# Altium schematic sheet P1.schdoc
size 297 x 210 mm; Symbol: Sheet-Symbol_A4; Company: 嘉立创EDA; Version: V1.0; Page Size: A4; @Project Name: AI开发板; @Page Count: 1; @Update Date: 2025-05-15; @Create Date: 2025-04-25; @Schematic Name: ESP-AI-V2; @Page No: 0; @Page Name: P1; Device: Sheet-Symbol_A4; @Board Name: Board2; @Create Time: 01:21:51; @Update Time: 10:08:04
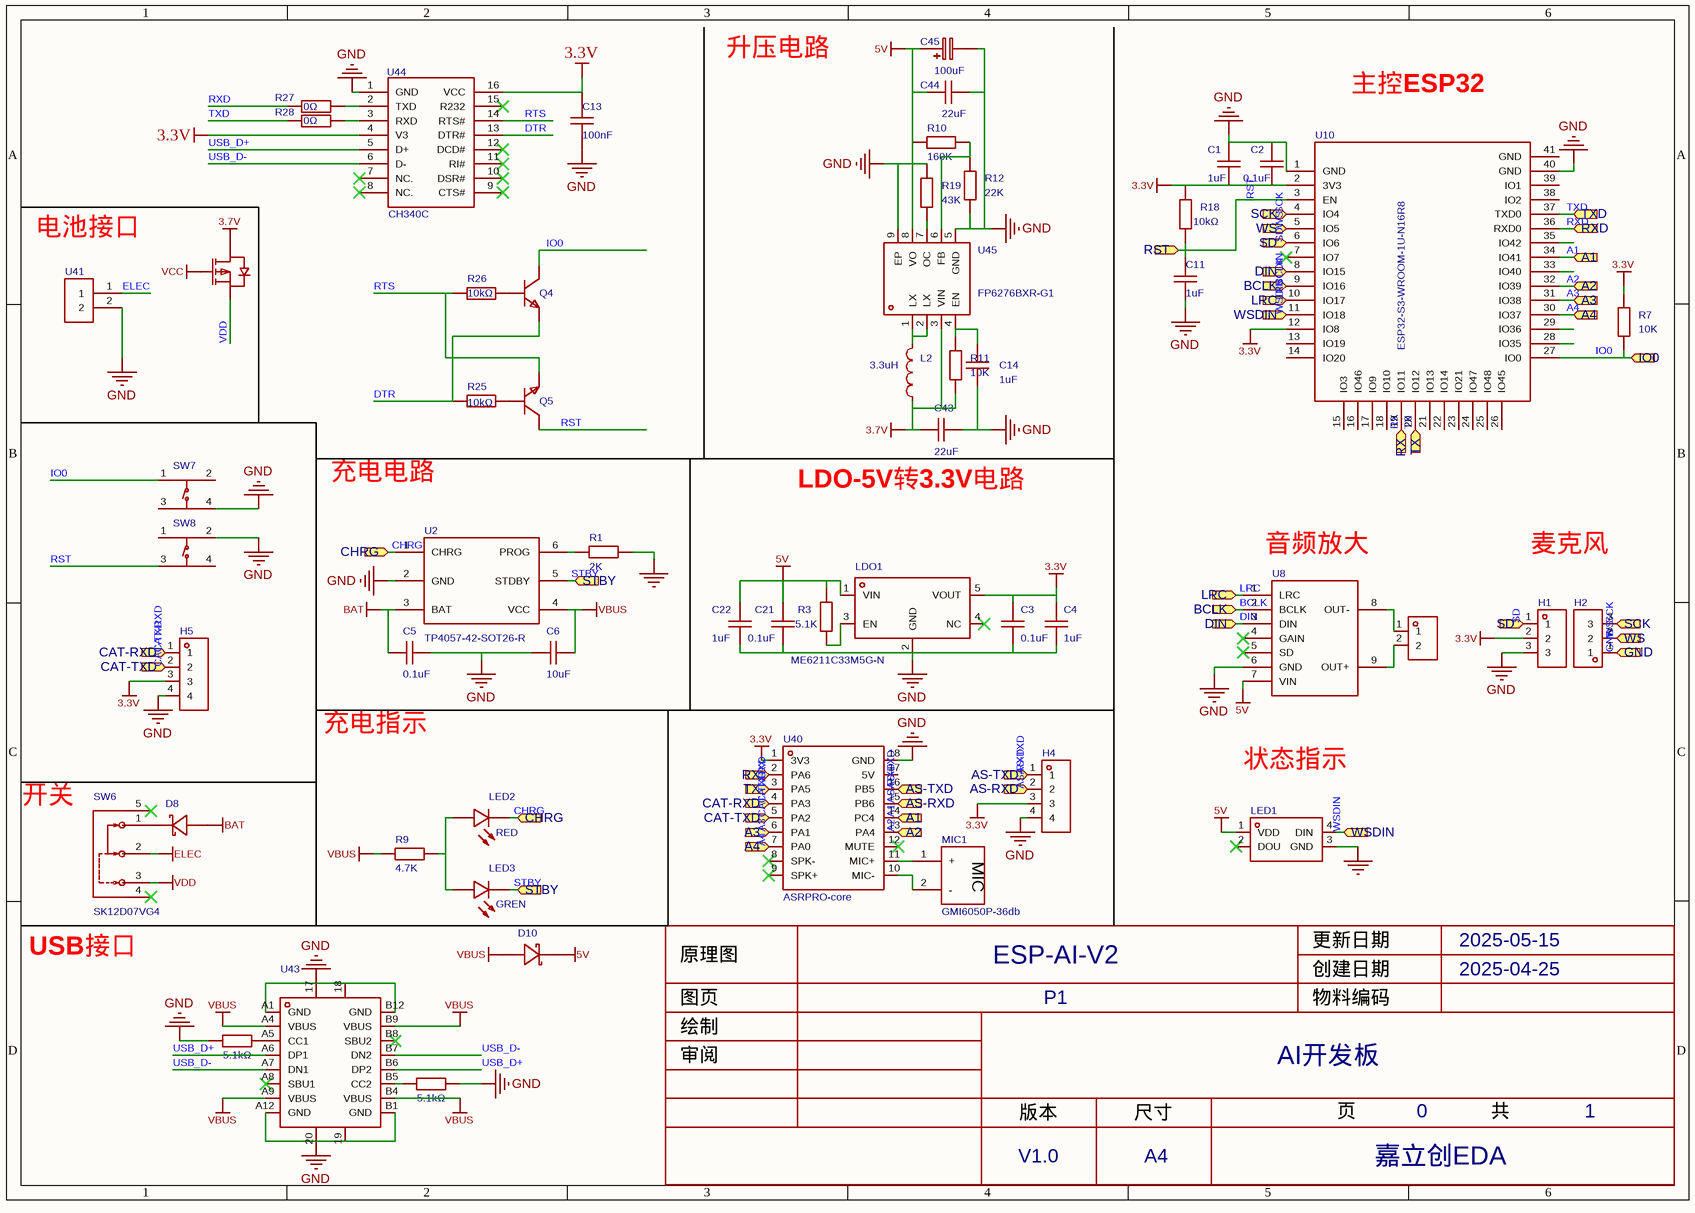
[diagram p0: P1.schdoc]

## Parts
C1  1uF  [C0603]
C2  0.1uF  [C0603]
C3  0.1uF  [C0603]
C4  1uF  [C0603]
C5  0.1uF  [C0603]
C6  10uF  [C0603]
C11  value 1uF  [C0603]  (hidden comment: CL10A105KB8NNNC)
C13  value 100nF  [C0603]  (hidden comment: CC0603KRX7R9BB104)
C14  1uF  [C0805]
C21  0.1uF  [C0603]
C22  1uF  [C0603]
C43  22uF  [C0805]
C44  22uF  [C0805]
C45  100uF  [CAP-SMD_L3.5-W2.8]
D8  1N5819WS_C727116  [SOD-323_L1.6-W1.3-LS2.7-RD]  (value not drawn)
D10  1N5819WS  [SOD-323_L1.8-W1.3-LS2.5-RD]  (value not drawn)
H1  PZ254V-11-03P  [HDR-TH_3P-P2.54-V-M]  (value not drawn)
H2  PZ254V-11-03P  [HDR-TH_3P-P2.54-V-M]  (value not drawn)
H3  PZ254V-11-02P  [HDR-TH_2P-P2.54-V-M]  (value not drawn)
H4  PZ254V-11-04P  [HDR-TH_4P-P2.54-V-M]  (value not drawn)
H5  PZ254V-11-04P  [HDR-TH_4P-P2.54-V-M]  (value not drawn)
L2  3.3uH  [IND-SMD_L7.0-W6.6]
LDO1  ME6211C33M5G-N  [SOT-23-5_L3.0-W1.7-P0.95-LS2.8-BL]
LED1  XL-5050RGBC-WS2812B  [LED-SMD_4P-L5.0-W5.0-BL_XL-5050RGBC]  (value not drawn)
LED2  RED  [LED0603-RD_RED]
LED3  GREN  [LED0603-RD_RED]
MIC1  GMI6050P-36db  [MIC-TH_BD6.0-P1.90-D0.4-L-FD_GMI6050P-2CXXDB]
Q2  AO3401_C727156  [SOT-23-3_L2.9-W1.4-P1.90-LS2.6-BR]  (value not drawn)
Q4  SS8050_C2150  [SOT-23-3_L2.9-W1.3-P1.90-LS2.4-BR]  (value not drawn)
Q5  SS8050_C2150  [SOT-23-3_L2.9-W1.3-P1.90-LS2.4-BR]  (value not drawn)
R1  2K  [R0603]
R3  5.1K  [R0603]
R6  value 5.1kΩ  [R0603]  (hidden comment: 0603WAF5101T5E)
R7  10K  [R0603]
R9  4.7K  [R0603]
R10  160K  [R0805_1]
R11  10K  [R0805_1]
R12  22K  [R0805_1]
R18  value 10kΩ  [R0603]  (hidden comment: 0603WAF1002T5E)
R19  43K  [R0805_1]
R23  value 5.1kΩ  [R0603]  (hidden comment: 0603WAF5101T5E)
R25  10kΩ  [R0603]
R26  10kΩ  [R0603]
R27  value 0Ω  [R0603]  (hidden comment: 0603WAF0000T5E)
R28  value 0Ω  [R0603]  (hidden comment: 0603WAF0000T5E)
SW6  SK12D07VG4  [SW-TH_SK12D07VG4]
SW7  TS-KG89S-AT25F  [SW-SMD_4P-L4.2-W3.3-P2.15-LS5.1]  (value not drawn)
SW8  TS-KG89S-AT25F  [SW-SMD_4P-L4.2-W3.3-P2.15-LS5.1]  (value not drawn)
U2  TP4057-42-SOT26-R  [SOT-23-6_L2.9-W1.6-P0.95-LS2.8-BL]
U8  (no value)  [MAX98357moudle]
U10  ESP32-S3-WROOM-1U-N16R8  [WIRELM-SMD_ESP32-S3-WROOM-1U]
U40  ASRPRO-core  [COMM-SMD_ASRPRO-CORE-V1.1]
U41  (no value)  [1*2-2.54单排针]
U43  24018-UCAF001-A  [TYPE-C-USB-SMD_CF003]  (value not drawn)
U44  CH340C  [SOP-16_L10.0-W3.9-P1.27-LS6.0-BL]
U45  FP6276BXR-G1  [SOP-8_L4.9-W3.9-P1.27-LS6.0-BL-EP]

## Ports
A1 (in), A2 (in), A3 (in), A4 (in), AS-RXD (in), AS-TXD (in), BCLK (in), CAT-RXD (in), CAT-TXD (in), CHRG (in), DIN (in), GND (in), IO0 (in), LRC (in), RST (in), RX (in), RXD (in), SCK (in), SD (in), STBY (in), TX (in), TXD (in), WS (in), WSDIN (in)

## Nets
3.3V: C1.1 C2.1 C3.2 C4.2 C13.1 H1.2 H4.3 H5.3 LDO1.5(VOUT) R7.2 R18.2 U10.2(3V3) U10.12(IO8) U40.1(3V3) U44.4(V3) U44.16(VCC)
3.7V: C43.2 L2.1 Q2.3(D) R11.2 U45.3(VIN)
5V: C21.2 C22.2 C44.2 C45.1 D10.1(K) LDO1.1(VIN) LED1.1(VDD) R3.1 R10.2 U8.7(VIN) U45.8(VO)
BAT: C5.2 D8.2(A) U2.3(BAT)
ELEC: SW6.2 U41.1
GND: C1.2 C2.2 C3.1 C4.1 C5.1 C6.2 C11.1 C13.2 C14.2 C21.1 C22.1 C43.1 C44.1 C45.2 H1.3 H2.1 H4.4 H5.4 LDO1.2(GND) LED1.3(GND) R1.1 R6.2 R12.2 R19.2 R23.1 SW7.4 SW8.2 U2.2(GND) U8.6(GND) U10.1(GND) U10.40(GND) U40.18(GND) U41.2 U43.17 U43.18 U43.19 U43.20 U43.A1(GND) U43.A12(GND) U43.B1(GND) U43.B12(GND) U44.1(GND) U45.5(GND) U45.9(EP) ; port GND
VBUS: C6.1 D10.2(A) R9.2 U2.4(VCC) U43.A4(VBUS) U43.A9(VBUS) U43.B4(VBUS) U43.B9(VBUS)
VCC: Q2.1(G)
VDD: Q2.2(S) SW6.3
A1: U10.34(IO41) U40.14(PC4) ; port A1
A2: U10.32(IO39) U40.13(PA4) ; port A2
A3: U10.31(IO38) U40.6(PA1) ; port A3
A4: U10.30(IO37) U40.7(PA0) ; port A4
AS-RXD: H4.2 U40.15(PB6) ; port AS-RXD
AS-TXD: H4.1 U40.16(PB5) ; port AS-TXD
BCLK: U8.2(BCLK) U10.9(IO16) ; port BCLK
CAT-RXD: H5.1 U40.4(PA3) ; port CAT-RXD
CAT-TXD: H5.2 U40.5(PA2) ; port CAT-TXD
CHRG: LED2.1(K) U2.1(CHRG) ; port CHRG
DIN: U8.3(DIN) U10.8(IO15) ; port DIN
DTR: Q4.2(E) R25.2 U44.13(DTR#)
IO0: Q4.3(C) R7.1 SW7.1 U10.27(IO0) ; port IO0
LRC: U8.1(LRC) U10.10(IO17) ; port LRC
RST: C11.2 Q5.3(C) R18.1 SW8.3 U10.3(EN) ; port RST
RTS: Q5.2(E) R26.2 U44.14(RTS#)
RX: U10.19(IO11) U40.2(PA6) ; port RX
RXD: R27.2 U10.36(RXD0) ; port RXD
SCK: H2.3 U10.4(IO4) ; port SCK
SD: H1.1 U10.6(IO6) ; port SD
STBY: LED3.1(K) U2.5(STDBY) ; port STBY
TX: U10.20(IO12) U40.3(PA5) ; port TX
TXD: R28.2 U10.37(TXD0) ; port TXD
USB_D+: U43.A6(DP1) U43.B6(DP2) U44.5(D+)
USB_D-: U43.A7(DN1) U43.B7(DN2) U44.6(D-)
WS: H2.2 U10.5(IO5) ; port WS
WSDIN: LED1.4(DIN) U10.11(IO18) ; port WSDIN
NetC14_1: C14.1 R11.1 U45.4(EN)
NetD8_1: D8.1(K) SW6.1
NetH3_1: H3.1 U8.8(OUT-)
NetH3_2: H3.2 U8.9(OUT+)
NetL2_2: L2.2 U45.1(LX) U45.2(LX)
NetLDO1_3: LDO1.3(EN) R3.2
NetLED2_2: LED2.2(A) LED3.2(A) R9.1
NetMIC1_1: MIC1.1(+) U40.11(MIC+)
NetMIC1_2: MIC1.2(-) U40.10(MIC-)
NetQ4_1: Q4.1(B) R26.1
NetQ5_1: Q5.1(B) R25.1
NetR1_2: R1.2 U2.6(PROG)
NetR6_1: R6.1 U43.B5(CC2)
NetR10_1: R10.1 R12.1 U45.6(FB)
NetR19_1: R19.1 U45.7(OC)
NetR23_2: R23.2 U43.A5(CC1)
NetR27_1: R27.1 U44.2(TXD)
NetR28_1: R28.1 U44.3(RXD)

Not connected (* = marked no-connect by the designer): LDO1 4(NC)*; LED1 2(DOU)*; SW6 4* 5*; SW7 2 3; SW8 1 4; U8 4(GAIN)* 5(SD)*; U10 7(IO7)* 13(IO19) 14(IO20) 15(IO3) 16(IO46) 17(IO9) 18(IO10) 21(IO13) 22(IO14) 23(IO21) 24(IO47) 25(IO48) 26(IO45) 28(IO35) 29(IO36) 33(IO40) 35(IO42) 38(IO2) 39(IO1) 41(GND); U40 8(SPK-)* 9(SPK+)* 12(MUTE)* 17(5V); U43 A8(SBU1)* B8(SBU2)*; U44 7(NC.)* 8(NC.)* 9(CTS#)* 10(DSR#)* 11(RI#)* 12(DCD#)* 15(R232)*

## Notes on the sheet
- 升压电路
- 主控ESP32
- (near U41) 电池接口
- 充电电路
- (near C43) LDO-5V转3.3V电路
- (near U8) 音频放大
- 麦克风
- 充电指示
- 状态指示
- 开关
- (near SW6) USB接口
- 更新日期
- 2025-05-15
- 原理图
- 图页
- ESP-AI-V2
- P1
- 创建日期
- 物料编码
- 2025-04-25
- 审阅
- 绘制
- AI开发板
- 版本
- V1.0
- 尺寸
- A4
- 页
- 0
- 嘉立创EDA
- 共
- 1
- (in symbol GMI6050P-36db) MIC

## Library data of the parts
C1-C6 C11 C14 C21 C22 C43 C44 = CL10A105KB8NNNC: 容值:1uF;精度:±10%;额定电压:50V;材质(温度系数):X5R;; Manufacturer: SAMSUNG(三星); AddInBom: yes; ModelId: ac125912035d415993ca9572d50418b1; ModelName: C0603_L1.6-W0.8-H0.8; ModelTransform: 62.992,31.496,0,0,0,0,0,0,0; Tolerance: ±10%; Voltage Rated: 50V; Temperature Coefficient: X5R; Device: CL10A105KB8NNNC; Symbol: CL10A105KB8NNNC; LCSC Part Name: 1uF±10%50V; ManufacturerPart: CL10A105KB8NNNC; Supplier Footprint: 0603; JLCPCB Part Class: BasicPart; Datasheet: https://atta.szlcsc.com/upload/public/pdf/source/20160103/1457707679084.pdf; Supplier: LCSC; ConvertToPcb: yes
  C1: SupplierPart: C15849; FootprintName: C0603; Value: 1uF
  C2 C3 C5 C21: Value: 0.1uF; FootprintName: C0603
  C4 C22: FootprintName: C0603; Value: 1uF
  C6: Value: 10uF; FootprintName: C0603
  C11: SupplierPart: C15849; FootprintName: C0603
  C14: SupplierPart: C15849; FootprintName: C0805; Value: 1uF
  C43 C44: Value: 22uF; FootprintName: C0805
C13 = CC0603KRX7R9BB104: 容值:100nF;精度:±10%;额定电压:50V;材质(温度系数):X7R;; Manufacturer: YAGEO(国巨); Symbol: C1210X7R475K630NT; AddInBom: yes; ModelId: ac125912035d415993ca9572d50418b1; ModelName: C0603_L1.6-W0.8-H0.8; ModelTransform: 62.992,31.496,0,0,0,0,0,0,0; Tolerance: ±10%; Voltage Rated: 50V; Temperature Coefficient: X7R; Device: CC0603KRX7R9BB104; LCSC Part Name: 100nF ±10% 50V; SupplierPart: C14663; ManufacturerPart: CC0603KRX7R9BB104; Supplier Footprint: 0603; JLCPCB Part Class: Basic Part; Datasheet: https://atta.szlcsc.com/upload/public/pdf/source/20170116/1484561234239.pdf; Supplier: LCSC; ConvertToPcb: yes; FootprintName: C0603
C45 = CA45B-B-6.3V-100UF-K: 容值:100uF;精度:±10%;额定电压:6.3V;; Manufacturer: CEC(振华新云); AddInBom: yes; ModelId: 0dfcda272f9b43668c6086d3a08712ba; ModelName: CASE-B_L3.5-W2.8-H1.9; ModelTransform: 145.669,110.236,0,180,0,0,0,0,0; Tolerance: ±10%; Rated Voltage: 6.3V; Device: CA45B-B-6.3V-100UF-K; Symbol: CA45B-B-6.3V-100UF-K; LCSC Part Name: 100uF ±10% 6.3V; SupplierPart: C2976908; ManufacturerPart: CA45B-B-6.3V-100UF-K; Supplier Footprint: SMD,2.8x3.5mm; Datasheet: https://atta.szlcsc.com/upload/public/pdf/source/20220222/C2C5F368BEBB90E653B4407F98E5644A.pdf; Supplier: LCSC; ConvertToPcb: yes; FootprintName: CAP-SMD_L3.5-W2.8; Value: 100uF; Operating Temperature: -55℃~+125℃
D8 = 1N5819WS_C727116: Manufacturer: TWGMC(台湾迪嘉); AddInBom: yes; ModelId: 39bca86493a8419684ee2090e9340edf; ModelTransform: 104.3305,51.181,0,0,0,0,0,0,0; Device: 1N5819WS_C727116; Symbol: 1N5819WS_C727116; LCSC Part Name: 1N5819WS; SupplierPart: C727116; ManufacturerPart: 1N5819WS; Supplier Footprint: SOD-323; JLCPCB Part Class: Extended Part; Datasheet: https://atta.szlcsc.com/upload/public/pdf/source/20200828/C727114_C14023D00363B04EEE1ED2B617BD8BD7.pdf; Supplier: LCSC; ConvertToPcb: yes; FootprintName: SOD-323_L1.6-W1.3-LS2.7-RD; ModelName: SOD-323_L1.6-W1.3-LS2.7-RD
D10 = 1N5819WS_C191023: 正向压降(Vf):600mV@1A;直流反向耐压(Vr):40V;整流电流:1A;; Manufacturer: Hottech(合科泰); Diode Configuration: 独立式; Average Rectified Current (Io): 3A; Reverse Leakage Current (Ir): 200uA@40V; Peak forward surge current: 80A; Symbol: 1N5819WS_C727116; AddInBom: yes; ModelId: e9dd044ee7bf4221b3b795eb56bce7c0; ModelName: SOD-323_L1.7-W1.3-H1.1-LS2.5; ModelTransform: 98.91933,51.181,0,180,0,0,0.985,-0.0005,0; Reverse Voltage (Vr): 40V; Rectified Current: 1A; Device: 1N5819WS_C191023; LCSC Part Name: 电压:40V 电流:1A; SupplierPart: C191023; ManufacturerPart: 1N5819WS; Supplier Footprint: SOD-323; JLCPCB Part Class: Basic Part; Datasheet: https://atta.szlcsc.com/upload/public/pdf/source/20220428/3CB86FD8D28D653594B4E35F9D5AEFD9.pdf; Supplier: LCSC; ConvertToPcb: yes; FootprintName: SOD-323_L1.8-W1.3-LS2.5-RD; Forward Voltage (Vf@If): 600mV@1A
H1 H2 = PZ254V-11-03P: 插针结构:1x3P;间距:2.54mm;行距:-;圆针/方针:方针;安装方式:直插;排数:单排;总PIN位数:3P;额定电流:3A;额定电压:250V;配合针长度:6mm;塑高:2.5mm;端接针长度:3mm;工作温度:-40℃~+105℃;颜色:黑色;; Manufacturer: XFCN(兴飞); Symbol: PZ254V-11-03P_C2937625; AddInBom: yes; ModelId: bb473b6d38ff42a99216a4fcdbdcc4cb; ModelName: HDR-TH_3P-P2.54-M-LI-1X3P; ModelTransform: 299.9994,100,0,0,0,0,0,0,-118.11; Pin Structure: 1x3P; Pitch: 2.54mm; Circluar Pins/Square Pins: 方针; Current Rating: 3A; Voltage Rating (Max): 250V; Device: PZ254V-11-03P; LCSC Part Name: 1x3P 间距:2.54mm 方针 直插; SupplierPart: C2937625; ManufacturerPart: PZ254V-11-03P; Supplier Footprint: 插件,P=2.54mm; JLCPCB Part Class: 扩展库; Datasheet: https://atta.szlcsc.com/upload/public/pdf/source/20200309/C492402_8335C3D49C4E4C618838D59BB1D024C1.pdf; Supplier: LCSC; ConvertToPcb: yes; FootprintName: HDR-TH_3P-P2.54-V-M; Row Spacing: -; Mounting Type: 直插; Number of Rows: 单排; Number of Pins: 3P; Length of Mating Pin: 6mm; Insulation Height: 2.5mm; Length of End Connection Pin: 3mm; Operating Temperature: -40℃~+105℃; Color: 黑色
H3 = PZ254V-11-02P: 插针结构:1x2P;间距:2.54mm;行距:-;圆针/方针:方针;安装方式:直插;排数:单排;总PIN位数:2P;额定电流:-;额定电压:-;配合针长度:6mm;塑高:2.5mm;端接针长度:3mm;触头材质:黄铜;触头镀层:-;工作温度:-40℃~+105℃;颜色:黑色;; Manufacturer: XFCN(兴飞); AddInBom: yes; ModelId: e35305ec3aa84b66b849f914b715e73f; ModelName: HDR2.54-M-LI-1X2P; ModelTransform: 200,100,0,0,0,0,0,0,-118.11; Pin Structure: 1x2P; Pitch: 2.54mm; Circluar Pins/Square Pins: 方针; Symbol: PZ254V-11-02P; Device: PZ254V-11-02P; LCSC Part Name: 1x2P 间距:2.54mm 方针 直插; SupplierPart: C492401; ManufacturerPart: PZ254V-11-02P; Supplier Footprint: 插件,P=2.54mm; JLCPCB Part Class: 扩展库; Datasheet: https://atta.szlcsc.com/upload/public/pdf/source/20200309/C492401_A812433581A9B211A7FFA413ADDFF0E5.pdf; Supplier: LCSC; ConvertToPcb: yes; FootprintName: HDR-TH_2P-P2.54-V-M; Row Spacing: -; Mounting Type: 直插; Number of Rows: 单排; Number of Pins: 2P; Current Rating: -; Voltage Rating (Max): -; Length of Mating Pin: 6mm; Insulation Height: 2.5mm; Length of End Connection Pin: 3mm; Contact Material: 黄铜; Contact Plating: -; Operating Temperature: -40℃~+105℃; Color: 黑色
H4 H5 = PZ254V-11-04P: 插针结构:1x4P;间距:2.54mm;行距:-;圆针/方针:方针;安装类型:直插;排数:单排;总PIN位数:4P;额定电流:3A;额定电压:250V;配合针长度:6mm;塑高:2.5mm;端接针长度:3mm;触头材质:-;工作温度范围:-40℃~+105℃;颜色:黑色;; Manufacturer: XFCN(兴飞); Symbol: PZ254V-11-04P_C2691448; AddInBom: yes; ModelId: 112f4d05e8d64e99ab9a333894bea4f9; ModelName: HDR-TH_4P-P2.54-M-LI-1X4P; ModelTransform: 399.999,104.7242,0,0,0,0,0,0,-118.11; Pin Structure: 1x4P; Pitch: 2.54mm; Circluar Pins/Square Pins: 方针; Current Rating (Max): 3A; Voltage Rating (Max): 250V; Device: PZ254V-11-04P; LCSC Part Name: 间距:2.54mm 1x4P 直插 方针; SupplierPart: C2691448; ManufacturerPart: PZ254V-11-04P; Supplier Footprint: 插件,P=2.54mm; JLCPCB Part Class: 扩展库; Datasheet: https://atta.szlcsc.com/upload/public/pdf/source/20200309/C492403_F9F19131791D08044AD4F84F8E751A34.pdf; Supplier: LCSC; ConvertToPcb: yes; FootprintName: HDR-TH_4P-P2.54-V-M; Row Spacing: -; Mounting Type: 直插; Number of Rows: 单排; Number of Pins: 4P; Length of Mating Pin: 6mm; Insulation Height: 2.5mm; Length of End Connection Pin: 3mm; Contact Material: -; Operating Temperature Range: -40℃~+105℃; Color: 黑色
L2 = FXL0630-3R3-M: 电感值:3.3uH;精度:±20%;额定电流:8.5A;饱和电流(Isat):9.5A;类型:一体成型电感;; Manufacturer: cjiang(长江微电); AddInBom: yes; ModelId: 6860c29aec394a38a0f014af7f722a42; ModelName: IND-SMD_L7.0-W6.6-H3.0; ModelTransform: 275.59,259.842,0,0,0,0,0,0,0; Tolerance: ±20%; Rated Current: 8.5A; Saturation Current (Isat): 9.5A; DC Resistance (DCR): 22mΩ; Type: 一体成型电感; Symbol: FXL0630-3R3-M; Device: FXL0630-3R3-M; LCSC Part Name: 3.3uH ±20% 9.5A; SupplierPart: C167219; ManufacturerPart: FXL0630-3R3-M; Supplier Footprint: SMD,6.6x7mm; Datasheet: https://atta.szlcsc.com/upload/public/pdf/source/20240426/3189EA8206330E2108542F9E34E540E7.pdf; Supplier: LCSC; ConvertToPcb: yes; FootprintName: IND-SMD_L7.0-W6.6; Value: 3.3uH
LDO1 = ME6211C33M5G-N: 输出类型:固定;输出极性:正;最大输入电压:6V;输出电压:3.3V;输出电流:500mA;电源纹波抑制比(PSRR):70dB;; Manufacturer: MICRONE(南京微盟); AddInBom: yes; Output Type: 固定; Output Polarity: 正; Number of Outputs: 1; Maximum Input Voltage: 6V; Output Voltage: 3.3V; Dropout Voltage: 260mV@(200mA); Output Current: 500mA; Power Supply Rejection Ratio (PSRR): 70dB; ModelId: 0a2a1b8f50944f73965918ad6e5fe167; ModelName: SOT-23-5_L2.9-W1.6-H1.1-LS2.8-P0.95; ModelTransform: 118.60433,114.173,0,90,0,0,0.0005,0.0005,0; Device: ME6211C33M5G-N; LCSC Part Name: ME6211C33M5G-N; SupplierPart: C82942; ManufacturerPart: ME6211C33M5G-N; Supplier Footprint: SOT-23-5; Datasheet: https://atta.szlcsc.com/upload/public/pdf/source/20170918/C82942_1505727073070976520.pdf; Supplier: LCSC; ConvertToPcb: yes; SymbolName: ME6211C33M5G-N; FootprintName: SOT-23-5_L3.0-W1.7-P0.95-LS2.8-BL
LED1 = XL-5050RGBC-WS2812B: 5050七彩幻彩透明贴片LED灯珠 5050 幻彩透明四脚 ws2812B 内置驱动IC; Manufacturer: XINGLIGHT(成兴光); AddInBom: yes; ModelId: 5168ba52986f49888734e6544170656a; ModelTransform: 212.598,196.85,0,270,0,0,0,0,0; Symbol: XL-5050RGBC-WS2812B; Device: XL-5050RGBC-WS2812B; LCSC Part Name: XL-5050RGBC-WS2812B; SupplierPart: C2843785; ManufacturerPart: XL-5050RGBC-WS2812B; Supplier Footprint: SMD5050; JLCPCB Part Class: 扩展库; Datasheet: https://atta.szlcsc.com/upload/public/pdf/source/20240412/E1004CAA80592E31D08BFE019083806F.pdf; Supplier: LCSC; ConvertToPcb: yes; FootprintName: LED-SMD_4P-L5.0-W5.0-BL_XL-5050RGBC; ModelName: LED-SMD_4P-L5.0-W5.0-BL_XL-5050RGBC
LED2 LED3 = NCD0603R1_C84263: 发光颜色:红灯;; Manufacturer: 国星光电; Symbol: FC-DA1608HRK-620D; AddInBom: yes; ModelId: 74041d3a270d435c8600a9ab9b7641c0; ModelTransform: 63.7794,31.496,0,0,0,0,0,0,0; Emitted Color: 红灯; Device: NCD0603R1_C84263; LCSC Part Name: 红灯; SupplierPart: C84263; Supplier Footprint: 0603; Datasheet: https://atta.szlcsc.com/upload/public/pdf/source/20200820/C84263_DABC6A75E58F576973B407FDBA283D60.pdf; Supplier: LCSC; ConvertToPcb: yes; FootprintName: LED0603-RD_RED; ModelName: LED0603-RD_RED
  LED2: Manufacturer Part: RED
  LED3: Manufacturer Part: GREN
MIC1 = GMI6050P-36db: Manufacturer: INGHAi(赢海); AddInBom: yes; ModelId: 13bff40b06b543799f1cf39aeb3f973a; ModelTransform: 236.22,235.915,0,0,0,0,0,-0.003,-118.11; Symbol: GMI6050P-36DB; Device: GMI6050P-36db; LCSC Part Name: 全指向φ6.0*5.0mm 1.5V-10V 灵敏度-36db 低阻抗 针脚; SupplierPart: C233939; ManufacturerPart: GMI6050P-36db; Supplier Footprint: 插件,D=6mm; JLCPCB Part Class: 扩展库; Datasheet: https://atta.szlcsc.com/upload/public/pdf/source/20180613/C233951_CF3F103FE3546E5F8FCD1BC0597FF08F.pdf; Supplier: LCSC; ConvertToPcb: yes; FootprintName: MIC-TH_BD6.0-P1.90-D0.4-L-FD_GMI6050P-2CXXDB; ModelName: MIC-TH_BD6.0-P1.90-D0.4-L-FD_GMI6050P-2CXXDB
Q2 = AO3401_C727156: 类型:1个P沟道;漏源电压(Vdss):30V;连续漏极电流(Id):4.2A;功率(Pd):350mW;导通电阻(RDS(on)@Vgs,Id):65mΩ@10V,4.2A;阈值电压(Vgs(th)@Id):1.3V@250uA;; Manufacturer: TWGMC(台湾迪嘉); ManufacturerPart: AO3401; AddInBom: yes; ModelId: 7c85ad3c8d5447da8c6dcc9f35565012; ModelTransform: 114.173,102.362,0,90,0,0,0,0,0; Type: 1个P沟道; Drain Source Voltage (Vdss): 30V; Power Dissipation (Pd): 350mW; Symbol: AO3401_C727156; Device: AO3401_C727156; LCSC Part Name: 1个P沟道 耐压:30V 电流:4.2A; SupplierPart: C727156; Supplier Footprint: SOT-23; JLCPCB Part Class: 扩展库; Datasheet: https://atta.szlcsc.com/upload/public/pdf/source/20200827/C727156_6E081BBEEFBC6B8FEE164CB196B0AF30.pdf; Supplier: LCSC; ConvertToPcb: yes; FootprintName: SOT-23-3_L2.9-W1.4-P1.90-LS2.6-BR; ModelName: SOT-23-3_L2.9-W1.4-P1.90-LS2.6-BR; Continuous Drain Current (Id): 4.2A; Drain Source On Resistance (RDS(on)@Vgs,Id): 65mΩ@10V,4.2A; Gate Threshold Voltage (Vgs(th)@Id): 1.3V@250uA; Total Gate Charge (Qg@Vgs): -; Input Capacitance (Ciss@Vds): -; Reverse Transfer Capacitance (Crss@Vds): -; Operating Temperature: -
Q4 Q5 = SS8050_C2150: 晶体管类型:NPN;集电极电流(Ic):1.5A;集射极击穿电压(Vceo):25V;功率(Pd):300mW;直流电流增益(hFE@Ic,Vce):200@100mA,1V;; Manufacturer: CJ(江苏长电/长晶); ManufacturerPart: SS8050; AddInBom: yes; ModelId: c62791f0466c4ae2a892c056b845b0ca; ModelName: SOT-23-3P_L2.9-W1.3-H1.0-LS2.4-P0.95; ModelTransform: 98.425,114.173,0,180,0,0,0.0005,-0.0005,0; Transistor Type: NPN; Collector Current (Ic): 1.5A; Collector-Emitter Breakdown Voltage (Vceo): 25V; Power Dissipation (Pd): 300mW; Transition Frequency (fT): 100MHz; Collector Cut-Off Current (Icbo): 100nA; Collector-Emitter Saturation Voltage (VCE(sat)@Ic,Ib): 500mV@800mA,80mA; Symbol: SS8050_C2150; Device: SS8050_C2150; LCSC Part Name: SS8050(RANGE:200-350) hfe=200~350; SupplierPart: C2150; Supplier Footprint: SOT-23; JLCPCB Part Class: 基础库; Datasheet: https://atta.szlcsc.com/upload/public/pdf/source/20230322/AEE86F4B043774EFF80CAEA14A37D9E9.pdf; Supplier: LCSC; ConvertToPcb: yes; FootprintName: SOT-23-3_L2.9-W1.3-P1.90-LS2.4-BR; DC Current Gain (hFE@Ic,Vce): 200@100mA,1V; Operating Temperature: -
R1 R3 R7 R9 R18 = 0603WAF1002T5E: 电阻类型:厚膜电阻;阻值:10kΩ;精度:±1%;功率:100mW;; Manufacturer: UNI-ROYAL(厚声); AddInBom: yes; ModelId: fc143cca1e79419f9cd78b61e9279f08; ModelTransform: 31.8897,63.7794,0,90,0,0,0,0,0; Tolerance: ±1%; Power(Watts): 100mW; Temperature Coefficient: ±100ppm/℃; Overload Voltage (Max): 75V; Device: 0603WAF1002T5E; Symbol: 0603WAF1002T5E; LCSC Part Name: 厚膜电阻10kΩ±1%100mW; ManufacturerPart: 0603WAF1002T5E; Supplier Footprint: 0603; JLCPCB Part Class: BasicPart; Datasheet: https://atta.szlcsc.com/upload/public/pdf/source/20200306/C422600_1E6D84923E4A46A82E41ADD87F860B5C.pdf; Supplier: LCSC; ConvertToPcb: yes; FootprintName: R0603; ModelName: R0603; Type: 厚膜电阻; Operating Temperature Range: -55℃~+155℃
  R1: Value: 2K
  R3: Value: 5.1K
  R7: Value: 10K
  R9: Value: 4.7K
  R18: SupplierPart: C25804
R6 R23 = 0603WAF5101T5E: 电阻类型:厚膜电阻;阻值:5.1kΩ;精度:±1%;功率:100mW;最大工作电压:75V;温度系数:±100ppm/℃;; Manufacturer: UNI-ROYAL(厚声); AddInBom: yes; ModelId: fc143cca1e79419f9cd78b61e9279f08; ModelTransform: 31.8897,63.7794,0,90,0,0,0,0,0; Tolerance: ±1%; Power(Watts): 100mW; Overload Voltage (Max): 75V; Symbol: 0603WAF5101T5E; Device: 0603WAF5101T5E; Supplier: LCSC; Manufacturer Part: 0603WAF5101T5E; Supplier Part: C23186; JLCPCB Part Class: 基础库; LCSC Part Name: 5.1kΩ ±1% 100mW 厚膜电阻; Supplier Footprint: 0603; Datasheet: https://atta.szlcsc.com/upload/public/pdf/source/20200306/C422600_1E6D84923E4A46A82E41ADD87F860B5C.pdf; ConvertToPcb: yes; FootprintName: R0603; ModelName: R0603; Type: 厚膜电阻; Temperature Coefficient: ±100ppm/℃; Operating Temperature Range: -55℃~+155℃
R10-R12 R19 = 0603WAF1002T5E: 电阻类型:厚膜电阻;阻值:10kΩ;精度:±1%;功率:100mW;; Manufacturer: UNI-ROYAL(厚声); AddInBom: yes; ModelId: fc143cca1e79419f9cd78b61e9279f08; ModelName: R0603; ModelTransform: 31.8897,63.7794,0,90,0,0,0,0,0; Tolerance: ±1%; Power(Watts): 100mW; Temperature Coefficient: ±100ppm/℃; Overload Voltage (Max): 75V; LCSC Part Name: 厚膜电阻10kΩ±1%100mW; Device: 0603WAF1002T5E; Symbol: 0603WAF1002T5E; ManufacturerPart: 0603WAF1002T5E; Supplier Footprint: 0603; JLCPCB Part Class: BasicPart; Datasheet: https://atta.szlcsc.com/upload/public/pdf/source/20200306/C422600_1E6D84923E4A46A82E41ADD87F860B5C.pdf; Supplier: LCSC; ConvertToPcb: yes; FootprintName: R0805_1; Type: 厚膜电阻; Operating Temperature Range: -55℃~+155℃
  R10: Value: 160K
  R11: Value: 10K
  R12: Value: 22K
  R19: Value: 43K
R25 R26 = 0603WAF1002T5E: 电阻类型:厚膜电阻;阻值:10kΩ;精度:±1%;功率:100mW;最大工作电压:75V;温度系数:±100ppm/℃;; Manufacturer: UNI-ROYAL(厚声); Symbol: 电阻_1; AddInBom: yes; ModelId: fc143cca1e79419f9cd78b61e9279f08; ModelTransform: 31.8897,63.7794,0,90,0,0,0,0,0; Tolerance: ±1%; Power(Watts): 100mW; Overload Voltage (Max): 75V; Value: 10kΩ; Device: 0603WAF1002T5E; LCSC Part Name: 厚膜电阻10kΩ±1%100mW; SupplierPart: C25804; ManufacturerPart: 0603WAF1002T5E; Supplier Footprint: 0603; JLCPCB Part Class: BasicPart; Datasheet: https://atta.szlcsc.com/upload/public/pdf/source/20200306/C422600_1E6D84923E4A46A82E41ADD87F860B5C.pdf; Supplier: LCSC; ConvertToPcb: yes; FootprintName: R0603; ModelName: R0603; Type: 厚膜电阻; Temperature Coefficient: ±100ppm/℃; Operating Temperature Range: -55℃~+155℃
R27 R28 = 0603WAF0000T5E: 电阻类型:厚膜电阻;阻值:0Ω;精度:±1%;功率:100mW;; Manufacturer: UNI-ROYAL(厚声); AddInBom: yes; ModelId: fc143cca1e79419f9cd78b61e9279f08; ModelTransform: 31.8897,63.7794,0,90,0,0,0,0,0; Tolerance: ±1%; Power(Watts): 100mW; Overload Voltage (Max): 75V; Device: 0603WAF0000T5E; Symbol: 0603WAF0000T5E; LCSC Part Name: 0Ω ±1% 100mW; SupplierPart: C21189; ManufacturerPart: 0603WAF0000T5E; Supplier Footprint: 0603; JLCPCB Part Class: Basic Part; Datasheet: https://atta.szlcsc.com/upload/public/pdf/source/20200306/C422600_1E6D84923E4A46A82E41ADD87F860B5C.pdf; Supplier: LCSC; ConvertToPcb: yes; FootprintName: R0603; ModelName: R0603; Type: 厚膜电阻; Operating Temperature Range: -55℃~+155℃
SW6 = SK12D07VG4: 电路结构:单刀双掷;安装方式:-;额定电流(DC):500mA;额定电压(DC):50V;额定电流(AC):-;额定电压(AC):-;机械寿命:5千次;; Manufacturer: SHOU HAN(首韩); AddInBom: yes; ModelId: 773c51563d484e3a80810244c5d56a16; ModelName: SW-TH_L8.7-W4.4-H4.0-P2.0; ModelTransform: 338.582,279.527,0,0,0,0,0,-51.181,-125.984; Circuit: 单刀双掷; Actuator Style: 矩形柱状; Pin Style: PC引脚; Switch Height: 8.8mm; Current Rating (DC): 500mA; Voltage Rating (DC): 50V; Mechanical Life: 5千次; Symbol: SK12D07VG4; Device: SK12D07VG4; LCSC Part Name: 3脚2档位 卧插 滑动开关; SupplierPart: C393937; ManufacturerPart: SK12D07VG4; Supplier Footprint: 插件; Datasheet: https://atta.szlcsc.com/upload/public/pdf/source/20190521/C393937_939FE26E571CC67D2D532E953108A1B0.pdf; Supplier: LCSC; ConvertToPcb: yes; FootprintName: SW-TH_SK12D07VG4; Mounting Style: -; Current Rating (AC): -; Voltage Rating (AC): -; Operating Temperature: -
SW7 SW8 = TS-KG89S-AT25F: 触点电流:50mA;额定电压(DC):12V;绝缘电阻:100MΩ;电路结构:单刀单掷;安装方式:立贴;作用力:250gf@±50gf;机械寿命:10万次;带支架:否;; Manufacturer: HANBO(汉博); AddInBom: yes; ModelId: 101da67941e24d4e9615179a94fc6132; ModelName: SW-SMD_4P-L4.2-W3.3-H2.5-P2.15-LS5.1; ModelTransform: 204.724,127.9525,0,0,0,0,0,0,0; Contact Current: 50mA; Voltage Rating (DC): 12V; Insulation Resistance: 100MΩ; Circuit: 单刀单掷; Actuator Style: 椭圆形按钮; Actuator/Cap Color: 白色; Mechanical Life: 10万次; Pin Style: SMD接片; Switch Length: 4.2mm; Switch Width: 3.25mm; Switch Height: 2.5mm; Strike Gundam: 否; Device: TS-KG89S-AT25F; Symbol: TS-KG89S-AT25F; LCSC Part Name: 4.2*3.25*2.5mm 立贴 轻触开关; SupplierPart: C2874599; ManufacturerPart: TS-KG89S-AT25F; Supplier Footprint: SMD; Datasheet: https://atta.szlcsc.com/upload/public/pdf/source/20221110/0D75E68DCC1CEC2670E8A2B9A9134A65.pdf; Supplier: LCSC; ConvertToPcb: yes; FootprintName: SW-SMD_4P-L4.2-W3.3-P2.15-LS5.1; Mounting Style: 立贴; Operating Force: 250gf@±50gf
U2 = TP4057-42-SOT26-R: Manufacturer: TOPPOWER(南京拓微); Symbol: TP4057; AddInBom: yes; ModelId: 18da8f6c14a34920b3e136b5c401a119; ModelName: SOT-23-6_L2.9-W1.6-H1.5-LS2.8-P0.95; ModelTransform: 110.236,113.364,0,90,0,0,0.0005,0.0005,0; Device: TP4057-42-SOT26-R; LCSC Part Name: TP4057 1%; SupplierPart: C12044; ManufacturerPart: TP4057-42-SOT26-R; Supplier Footprint: SOT-23-6; JLCPCB Part Class: Basic Part; Datasheet: https://atta.szlcsc.com/upload/public/pdf/source/20140228/1457706997013.pdf; Supplier: LCSC; ConvertToPcb: yes; FootprintName: SOT-23-6_L2.9-W1.6-P0.95-LS2.8-BL
U8 = MAX98357模块: AddInBom: yes; Device: MAX98357模块; ConvertToPcb: yes; SymbolName: MAX98357模块; FootprintName: MAX98357moudle
U10 = ESP32-S3-WROOM-1U-N16R8: Manufacturer: ESPRESSIF(乐鑫); AddInBom: yes; ModelId: 36199533deec4e26b7f6f73abf45ee22; ModelTransform: 709.4474,756.2977,0,0,0,0,0,19.685,0; Symbol: ESP32-S3-WROOM-1U-N16R8; Device: ESP32-S3-WROOM-1U-N16R8; LCSC Part Name: ESP32-S3-WROOM-1U-N16R8; SupplierPart: C3013946; ManufacturerPart: ESP32-S3-WROOM-1U-N16R8; Supplier Footprint: SMD,18x19.2mm; JLCPCB Part Class: 扩展库; Datasheet: https://atta.szlcsc.com/upload/public/pdf/source/20240130/9D71F4DF55874C504AB629FEEE3F038E.pdf; Supplier: LCSC; ConvertToPcb: yes; FootprintName: WIRELM-SMD_ESP32-S3-WROOM-1U; ModelName: WIRELM-SMD_ESP32-S3-WROOM-1U
U40 = ASRPRO-core_C9900107962: AddInBom: yes; ModelId: 82c6c2c4b6df4cbbb6ec1b70d6ce4b07; ModelTransform: 688.975,885.825,0,0,0,0,0,0,0; Symbol: ASRPRO-CORE_C9900107962; Device: ASRPRO-core_C9900107962; LCSC Part Name: ASRPRO-core; SupplierPart: C9900107962; ManufacturerPart: ASRPRO-core; Supplier Footprint: SMD-18; JLCPCB Part Class: Extended Part; Supplier: LCSC; ConvertToPcb: yes; FootprintName: COMM-SMD_ASRPRO-CORE-V1.1; ModelName: COMM-SMD_ASRPRO-CORE-V1.1
U41 = 2.54-2P排针: AddInBom: yes; Symbol: 2.54-2P排针; Device: 2.54-2P排针; ConvertToPcb: yes; FootprintName: 1*2-2.54单排针
U43 = 24018-UCAF001-A: TYPE C 16P母座加高1.0 H=4.25无弹; Manufacturer: MINTRON(明硕); AddInBom: yes; ModelId: 8053cd499aa443d4a459f0ef67fa7afc; ModelTransform: 351.9678,307.086,0,180,0,0,0.001,-42.044,-43.307; Device: 24018-UCAF001-A; Symbol: 24018-UCAF001-A; LCSC Part Name: TYPE C; SupplierPart: C3148202; ManufacturerPart: 24018-UCAF001-A; Supplier Footprint: SMD; JLCPCB Part Class: Extended Part; Datasheet: https://atta.szlcsc.com/upload/public/pdf/source/20220705/E5F2CA3AC83E324DB8CC8FCBE4CC7AA7.pdf; Supplier: LCSC; ConvertToPcb: yes; FootprintName: TYPE-C-USB-SMD_CF003; ModelName: TYPE-C-USB-SMD_CF003
U44 = CH340C: 类型:Transceiver;协议类别:USB 2.0;驱动器/接收器数:-;数据速率:2Mbps;; Manufacturer: WCH(南京沁恒); AddInBom: yes; ModelId: 3361a6792abf4a8f8fbca4f1924a67ee; ModelName: SOP-16_L9.9-W3.9-H1.5-LS6.0-P1.27; ModelTransform: 240.39054,393.7,0,90,0,0,0,0,0; Protocol: USB 2.0; Data Rate: 2Mbps; Supply Voltage: 3.3V, 5V; Device: CH340C; Symbol: CH340C; LCSC Part Name: CH340C; SupplierPart: C84681; ManufacturerPart: CH340C; Supplier Footprint: SOP-16_150mil; JLCPCB Part Class: Extended Part; Datasheet: https://atta.szlcsc.com/upload/public/pdf/source/20200819/C84681_ADBED554CE321879DBD6B1D06488689C.pdf; Supplier: LCSC; ConvertToPcb: yes; FootprintName: SOP-16_L10.0-W3.9-P1.27-LS6.0-BL; Type: Transceiver; Number of Drivers/Receivers: -
U45 = FP6276BXR-G1: 功能类型:升压型;输入电压:2.4V~4.5V;输出电压:5.3V;输出电流(最大值):6A;; Manufacturer: Advanced Analog Technology(类比); AddInBom: yes; ModelId: 94c97984fe8342edbe821bc2ce85d11e; ModelName: SOP-8_L4.9-W3.9-H1.7-LS6.0-P1.30; ModelTransform: 236.22,839.658,0,90,0,0,0.0005,-0.0005,0; Function: 升压型; Output Voltage: 5.3V; Output Current (Max): 6A; Switching Frequency: 500kHz; Synchronous Rectification: 是; Number of Outputs: 1; Topology: 升压式; Switch tube (built-in/external): 内置; Device: FP6276BXR-G1; Symbol: FP6276BXR-G1; LCSC Part Name: FP6276BXR-G1; SupplierPart: C82652; ManufacturerPart: FP6276BXR-G1; Supplier Footprint: SOP-8-EP; JLCPCB Part Class: 扩展库; Datasheet: https://atta.szlcsc.com/upload/public/pdf/source/20170315/1489573065037.pdf; Supplier: LCSC; ConvertToPcb: yes; FootprintName: SOP-8_L4.9-W3.9-P1.27-LS6.0-BL-EP; Input Voltage: 2.4V~4.5V